# Altium schematic sheet drvoutput2.SchDoc
size A4
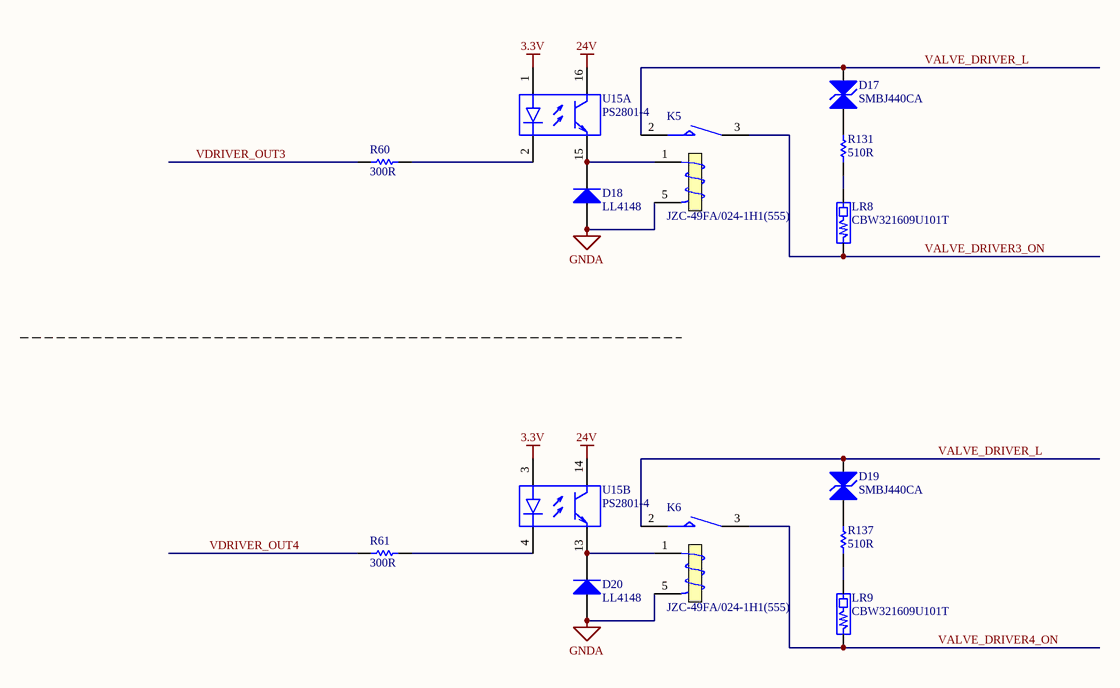
[diagram p0: drvoutput2.SchDoc]

## Parts
D17  SMBJ440CA  [SMB]
D18  LL4148  [CD2012-0805]
D19  SMBJ440CA  [SMB]
D20  LL4148  [CD2012-0805]
K5  JZC-49FA/024-1H1(555)  [JZC-49FA]
K6  JZC-49FA/024-1H1(555)  [JZC-49FA]
LR8  CBW321609U101T  [INDC3216M]
LR9  CBW321609U101T  [INDC3216M]
R60  300R  [RESC2012M]
R61  300R  [RESC2012M]
R131  510R  [RESC3216M]
R137  510R  [RESC3216M]
U15  PS2801-4  [SOIC16_N]  (parts A,B of 4)

## Nets
3.3V: U15.1(+) U15.3(+)
24V: U15.14(C) U15.16(C)
GNDA: D18.1(A) D20.1(A) K5.5(T2) K6.5(T2)
VALVE_DRIVER3_ON: K5.3(NO) LR8.1
VALVE_DRIVER4_ON: K6.3(NO) LR9.1
VALVE_DRIVER_L: D17.2(K) D19.2(K) K5.2(COM) K6.2(COM)
VDRIVER_OUT3: R60.1
VDRIVER_OUT4: R61.1
NetD17_1: D17.1(A) R131.2
NetD18_2: D18.2(K) K5.1 U15.15(E)
NetD19_1: D19.1(A) R137.2
NetD20_2: D20.2(K) K6.1 U15.13(E)
NetLR8_2: LR8.2 R131.1
NetLR9_2: LR9.2 R137.1
NetR60_2: R60.2 U15.2(-)
NetR61_2: R61.2 U15.4(-)

## Library data of the parts
D17 D19 = Bi-dir TVS Diode: Published: 8-Jun-2000; LatestRevisionDate: 17-Jul-2002; LatestRevisionNote: Re-released for DXP Platform.; PackageReference: DIODE-0.7; Publisher: Altium Limited
D18 D20 = Diode 1N4007: 1 Amp General Purpose Rectifier; Published: 8-Jun-2000; LatestRevisionDate: 17-Jul-2002; LatestRevisionNote: Re-released for DXP Platform.; DatasheetVersion: 1998; PackageVersion: Aug-1999; PackageReference: DO-41; Publisher: Altium Limited; Code_JEDEC: DO-204-AL; ComponentLink1Description: Manufacturer Link; ComponentLink1URL: http://www.fairchildsemi.com/; ComponentLink2Description: Datasheet; ComponentLink2URL: http://www.fairchildsemi.com/ds/1N%2F1N4001.pdf
K5 K6 = JZC-49FA: Intermediate  Power  Relay; Published: 8-Jun-2000; LatestRevisionDate: 17-Jul-2002; LatestRevisionNote: Re-released for DXP Platform.; PackageReference: MODULE5B; Publisher: Altium Limited
LR8 LR9 = BLM10/11/21/31/41: EMI FILTERS,DC Resistance max.0.05~1.5 ohms,10 ~ 1000 ohms at 100MHz  Frequency
R60 R61 = Res1: Resistor; Value: 10K; Published: 8-Jun-2000; LatestRevisionDate: 17-Jul-2002; LatestRevisionNote: Re-released for DXP Platform.; PackageReference: AXIAL-0.3; Publisher: Altium Limited
R131 R137 = Res1: Metal film Resistor; Value: 10K; Published: 8-Jun-2000; LatestRevisionDate: 17-Jul-2002; LatestRevisionNote: Re-released for DXP Platform.; PackageReference: AXIAL-0.3; Publisher: Altium Limited
U15 = PS2801-4: The PS2801-1 and PS2801-4 are optically coupled isolators containing a GaAs light emitting diode and an NPN  silicon phototransistor in a plastic SOP for high density applications.; Published: 28-Feb-2003; LatestRevisionDate: 13-Apr-2006; LatestRevisionNote: IPC-7351 Footprint Added.; DatasheetVersion: Jan-2002, Rev. 7; PackageVersion: rev7, Jan-2002; PackageReference: 751-07; Publisher: Altium Limited; PackageDescription: 8-Pin Plastic Small Outline Integrated Circuit 1.27 mm Pitch; Code_JEDEC: MS-012-AA; Code_IPC: SOIC127P600-8; ComponentLink1Description: Manufacturer Link; ComponentLink1URL: http://www.onsemi.com/; ComponentLink2Description: Datasheet; ComponentLink2URL: http://www.onsemi.com/pub/Collateral/LM358-D.PDF